# Altium schematic sheet Test-USB_SHUTDOWN.SchDoc
size A4; DrawnBy: Philip Rowse
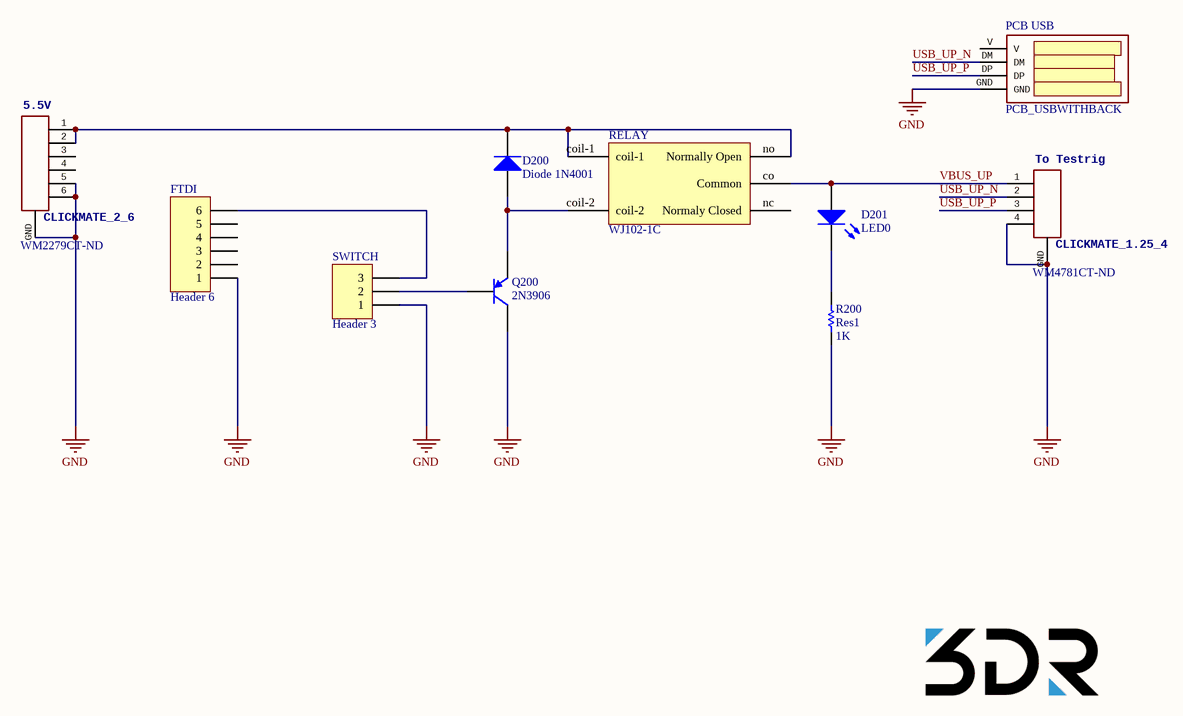
[diagram p0: Test-USB_SHUTDOWN.SchDoc]

## Parts
3DR_Logo_2  DO NOT PLACE  [3DR_AU]  (value not drawn)
5.5V  CLICKMATE_2_6  Supplier Part Number 1: WM2279CT-ND  [CLICKMATE_H6_2MM]
D200  Diode 1N4001  [DO-41]
D201  LED0  [LED-0]
FTDI  Header 6  [HDR1X6]
PCB_USB  PCB_USBWITHBACK  [PCB_USB_WBACK]
Q200  2N3906  [TO-92A]
R200  Res1  value 1K  [AXIAL-0.3]
RELAY  WJ102-1C  [WJ1D2-1C]
SWITCH  Header 3  [HDR1X3]
To_Testrig  CLICKMATE_1.25_4  Supplier Part Number 1: WM4781CT-ND  [CLICKMATE_V4]

## Nets
GND: 5.5V.5 5.5V.6 5.5V.GND FTDI.1 PCB_USB.GND Q200.3(C) R200.1 SWITCH.1 To_Testrig.4 To_Testrig.GND
USB_UP_N: PCB_USB.DM To_Testrig.2
USB_UP_P: PCB_USB.DP To_Testrig.3
VBUS_UP: D201.1(A) RELAY.co(Common) To_Testrig.1
Net5.5V_1: 5.5V.1 5.5V.2 D200.2(K) RELAY.coil-1 RELAY.no(Normally_Open)
NetD200_1: D200.1(A) Q200.1(E) RELAY.coil-2
NetD201_2: D201.2(K) R200.2
NetFTDI_6: FTDI.6 SWITCH.3
NetQ200_2: Q200.2(B) SWITCH.2

Not connected (* = marked no-connect by the designer): 5.5V 3 4; FTDI 2 3 4 5; PCB_USB V; RELAY nc(Normaly_Closed)

## Notes on the sheet
- http://www.oshwa.org/
- http://creativecommons.org/licenses/by-sa/3.0/
- Title:
- Date:
- Time:
- Sheet:
- Approved:
- of:
- Drawn By:
- Checked By:
- 3DRobotics

## Library data of the parts
3DR_Logo_2 = 3DR_LOGO
5.5V = CLICKMATE_2_6: Connector, Header, 6Pos, 2.54MM, Vert, THT, Au; 3DR_PARTNO: PRT0445; Supplier 1: Digi-Key
D200 = Diode 1N4001: 1 Amp General Purpose Rectifier; Published: 8-Jun-2000; LatestRevisionDate: 17-Jul-2002; LatestRevisionNote: Re-released for DXP Platform.; DatasheetVersion: 1998; PackageVersion: Aug-1999; PackageReference: DO-41; Publisher: Altium Limited; PackageDescription: Diode, Axial; Body 5.2 x 2.7 mm (LxDia. max), Lead Dia. 0.86 mm (max); Code_JEDEC: DO-204-AL; ComponentLink1Description: Manufacturer Link; ComponentLink1URL: http://www.fairchildsemi.com/; ComponentLink2Description: Datasheet; ComponentLink2URL: http://www.fairchildsemi.com/ds/1N%2F1N4001.pdf
D201 = LED0: Typical INFRARED GaAs LED; Published: 8-Jun-2000; LatestRevisionDate: 08-Jul-2005; LatestRevisionNote: Mech Layer 1 removed.; PackageReference: LED-0; Publisher: Altium Limited; PackageDescription: LED; 2 Leads
FTDI = Header 6: Header, 6-Pin; LatestRevisionDate: 17-Jul-2002; LatestRevisionNote: Re-released for DXP Platform.; Publisher: Altium Limited
Q200 = 2N3906: PNP General Purpose Amplifier; Published: 8-Jun-2000; LatestRevisionDate: 15-Jan-2003; LatestRevisionNote: PCB Footprint 'BCY-W3/D4.7' replaced; DatasheetVersion: 1997; PackageVersion: Sep-1998; PackageReference: TO-92A; Publisher: Altium Limited; PackageDescription: TO, Flat Index; 3 In-Line, Axial Leads; Body Dia. 4.5mm; Leads 0.51 x 0.48 mm (max); ComponentLink1Description: Manufacturer Link; ComponentLink1URL: http://www.fairchildsemi.com/; ComponentLink2Description: Datasheet; ComponentLink2URL: http://www.fairchildsemi.com/ds/2N%2F2N3906.pdf
R200 = Res1: Resistor; Published: 8-Jun-2000; LatestRevisionDate: 17-Jul-2002; LatestRevisionNote: Re-released for DXP Platform.; PackageReference: AXIAL-0.3; Publisher: Altium Limited; PackageDescription: Axial Device, Thru-Hole; 2 Leads; 0.3 in Pin Spacing
SWITCH = Header 3: Header, 3-Pin; LatestRevisionDate: 17-Jul-2002; LatestRevisionNote: Re-released for DXP Platform.; Publisher: Altium Limited
To_Testrig = CLICKMATE_1.25_4: Connector, Rcpt, 4Pos, 1.25MM, W/B, VERT, SMD, Tin; 3DR_PARTNO: PRT0441; Supplier 1: Digi-Key